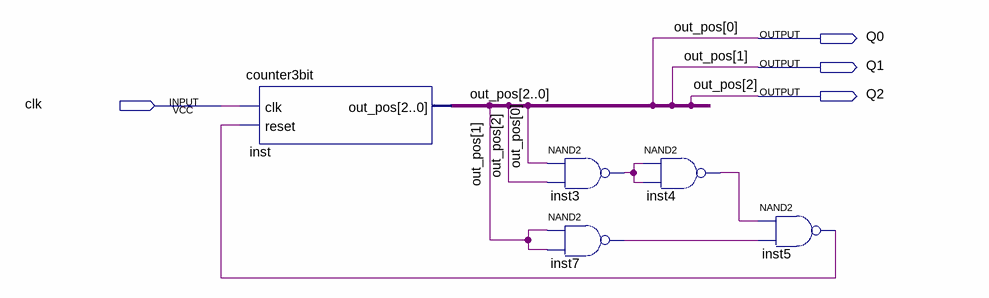
[diagram p0: schematic sheet]
// Quartus schematic counter3Bit_reset.bdf as structural Verilog: 5 symbols, 4 pins
module counter3Bit_reset (
  input  clk,
  output Q0,
  output Q1,
  output Q2
);

  wire inst3_out, inst4_out, inst5_out, inst7_out;

  counter3bit inst (.clk(clk), .reset(inst5_out), .out_pos({Q2, Q1, Q0}));
  nand inst3 (inst3_out, Q0, Q2);
  nand inst7 (inst7_out, Q1, Q1);
  nand inst4 (inst4_out, inst3_out, inst3_out);
  nand inst5 (inst5_out, inst4_out, inst7_out);

  // Other names for the same wires on the sheet: out_pos[2:0] = {Q2, Q1, Q0}
endmodule
